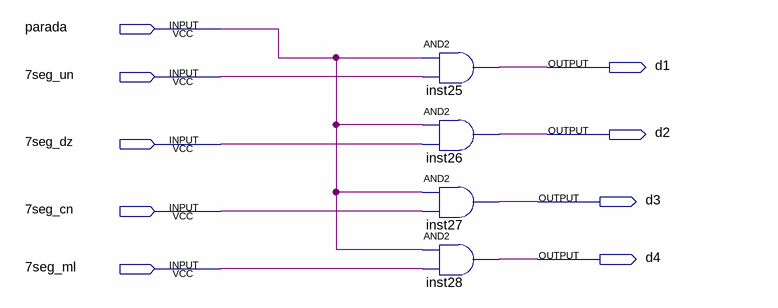
[diagram p0: schematic sheet]
// Quartus schematic Ativador_display.bdf as structural Verilog: 4 symbols, 9 pins
module Ativador_display (
  input  parada,
  input  \7seg_un ,
  input  \7seg_dz ,
  input  \7seg_cn ,
  input  \7seg_ml ,
  output d1,
  output d2,
  output d3,
  output d4
);

  and inst25 (d1, parada, \7seg_un );
  and inst26 (d2, parada, \7seg_dz );
  and inst27 (d3, parada, \7seg_cn );
  and inst28 (d4, parada, \7seg_ml );
endmodule
